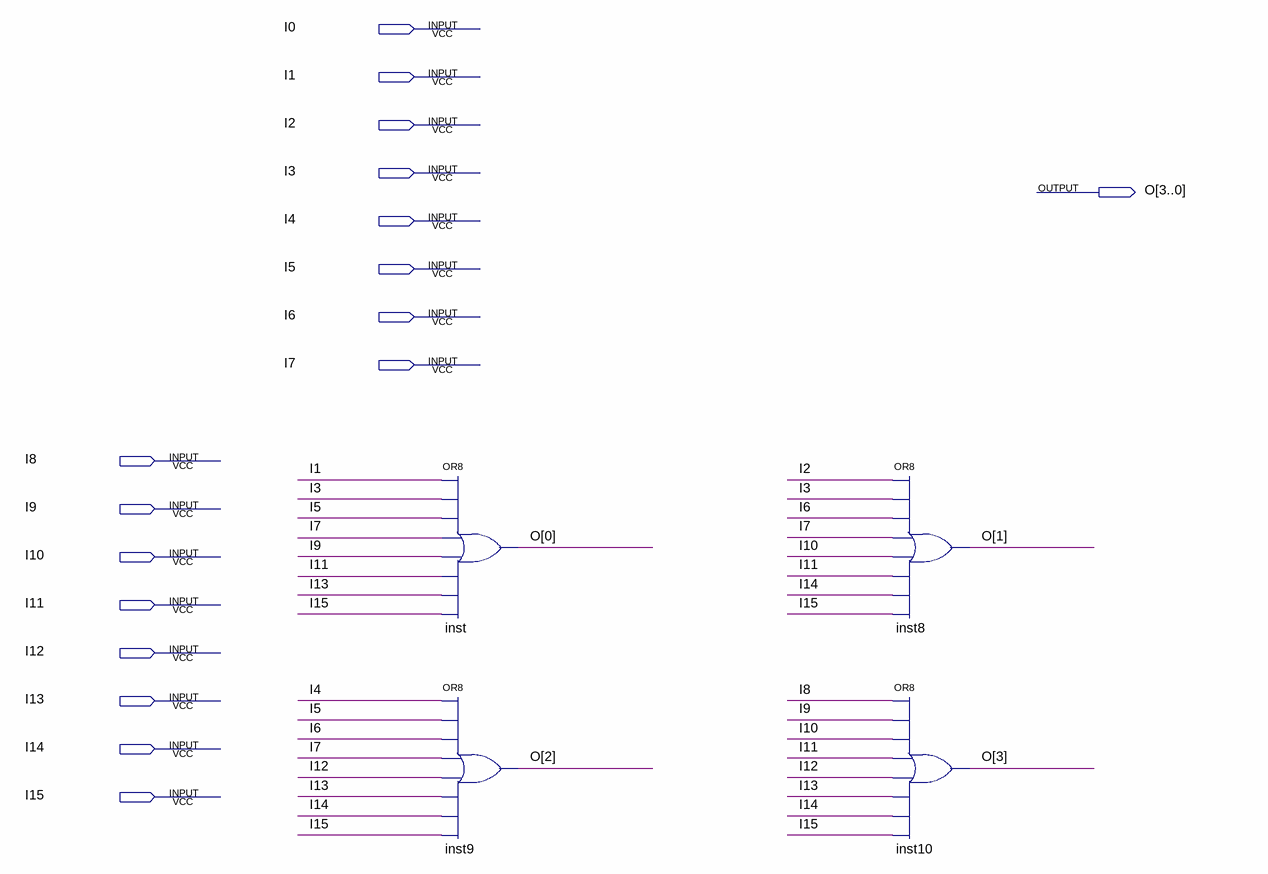
[diagram p0: schematic sheet]
// Quartus schematic encoder16.bdf as structural Verilog: 4 symbols, 17 pins
module encoder16 (
  input  I0,
  input  I1,
  input  I2,
  input  I3,
  input  I4,
  input  I5,
  input  I6,
  input  I7,
  input  I8,
  input  I9,
  input  I10,
  input  I11,
  input  I12,
  input  I13,
  input  I14,
  input  I15,
  output [3:0] O
);

  or inst (O[0], I1, I3, I5, I7, I9, I11, I13, I15);
  or inst9 (O[2], I4, I5, I6, I7, I12, I13, I14, I15);
  or inst8 (O[1], I2, I3, I6, I7, I10, I11, I14, I15);
  or inst10 (O[3], I8, I9, I10, I11, I12, I13, I14, I15);
endmodule
